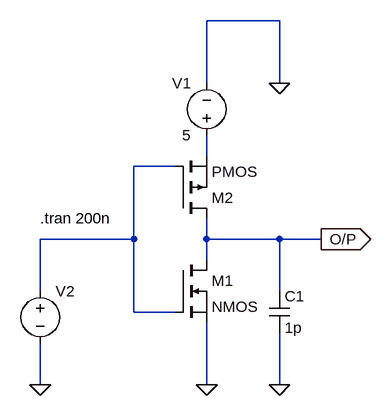
[diagram p0: schematic Inverter.asc]
Inverter.asc, the LTspice schematic file:
Version 4
SHEET 1 880 680
WIRE 352 -176 240 -176
WIRE 240 -80 240 -176
WIRE 352 -80 352 -176
WIRE 240 32 240 0
WIRE 192 48 128 48
WIRE 128 160 128 48
WIRE 128 160 -16 160
WIRE 240 160 240 128
WIRE 352 160 240 160
WIRE 416 160 352 160
WIRE 240 192 240 160
WIRE -16 240 -16 160
WIRE 352 240 352 160
WIRE 128 272 128 160
WIRE 192 272 128 272
WIRE -16 384 -16 320
WIRE 240 384 240 288
WIRE 352 384 352 304
FLAG -16 384 0
FLAG 352 -80 0
FLAG 240 384 0
FLAG 352 384 0
FLAG 416 160 O/P
IOPIN 416 160 Out
SYMBOL nmos 192 192 R0
SYMATTR InstName M1
SYMBOL pmos 192 128 M180
SYMATTR InstName M2
SYMBOL voltage 240 16 R180
WINDOW 0 24 96 Left 2
WINDOW 3 24 16 Left 2
WINDOW 123 0 0 Left 0
WINDOW 39 0 0 Left 0
SYMATTR InstName V1
SYMATTR Value 5
SYMBOL voltage -16 224 R0
WINDOW 123 0 0 Left 0
WINDOW 39 0 0 Left 0
WINDOW 3 -181 118 Invisible 2
SYMATTR Value PULSE(0 5 0 1p 1p 100n 200n 2)
SYMATTR InstName V2
SYMBOL cap 336 240 R0
SYMATTR InstName C1
SYMATTR Value 1p
TEXT -16 128 Left 2 !.tran 200n

The netlist it stands for:
* Inverter.asc
M1 O/P N002 0 0 NMOS
M2 O/P N002 N001 N001 PMOS
V1 N001 0 5
V2 N002 0 PULSE(0 5 0 1p 1p 100n 200n 2)
C1 O/P 0 1p
.model NMOS NMOS
.model PMOS PMOS
.lib standard.mos
.tran 200n
.backanno
.end